# Altium project Bran_Download.PrjPcb
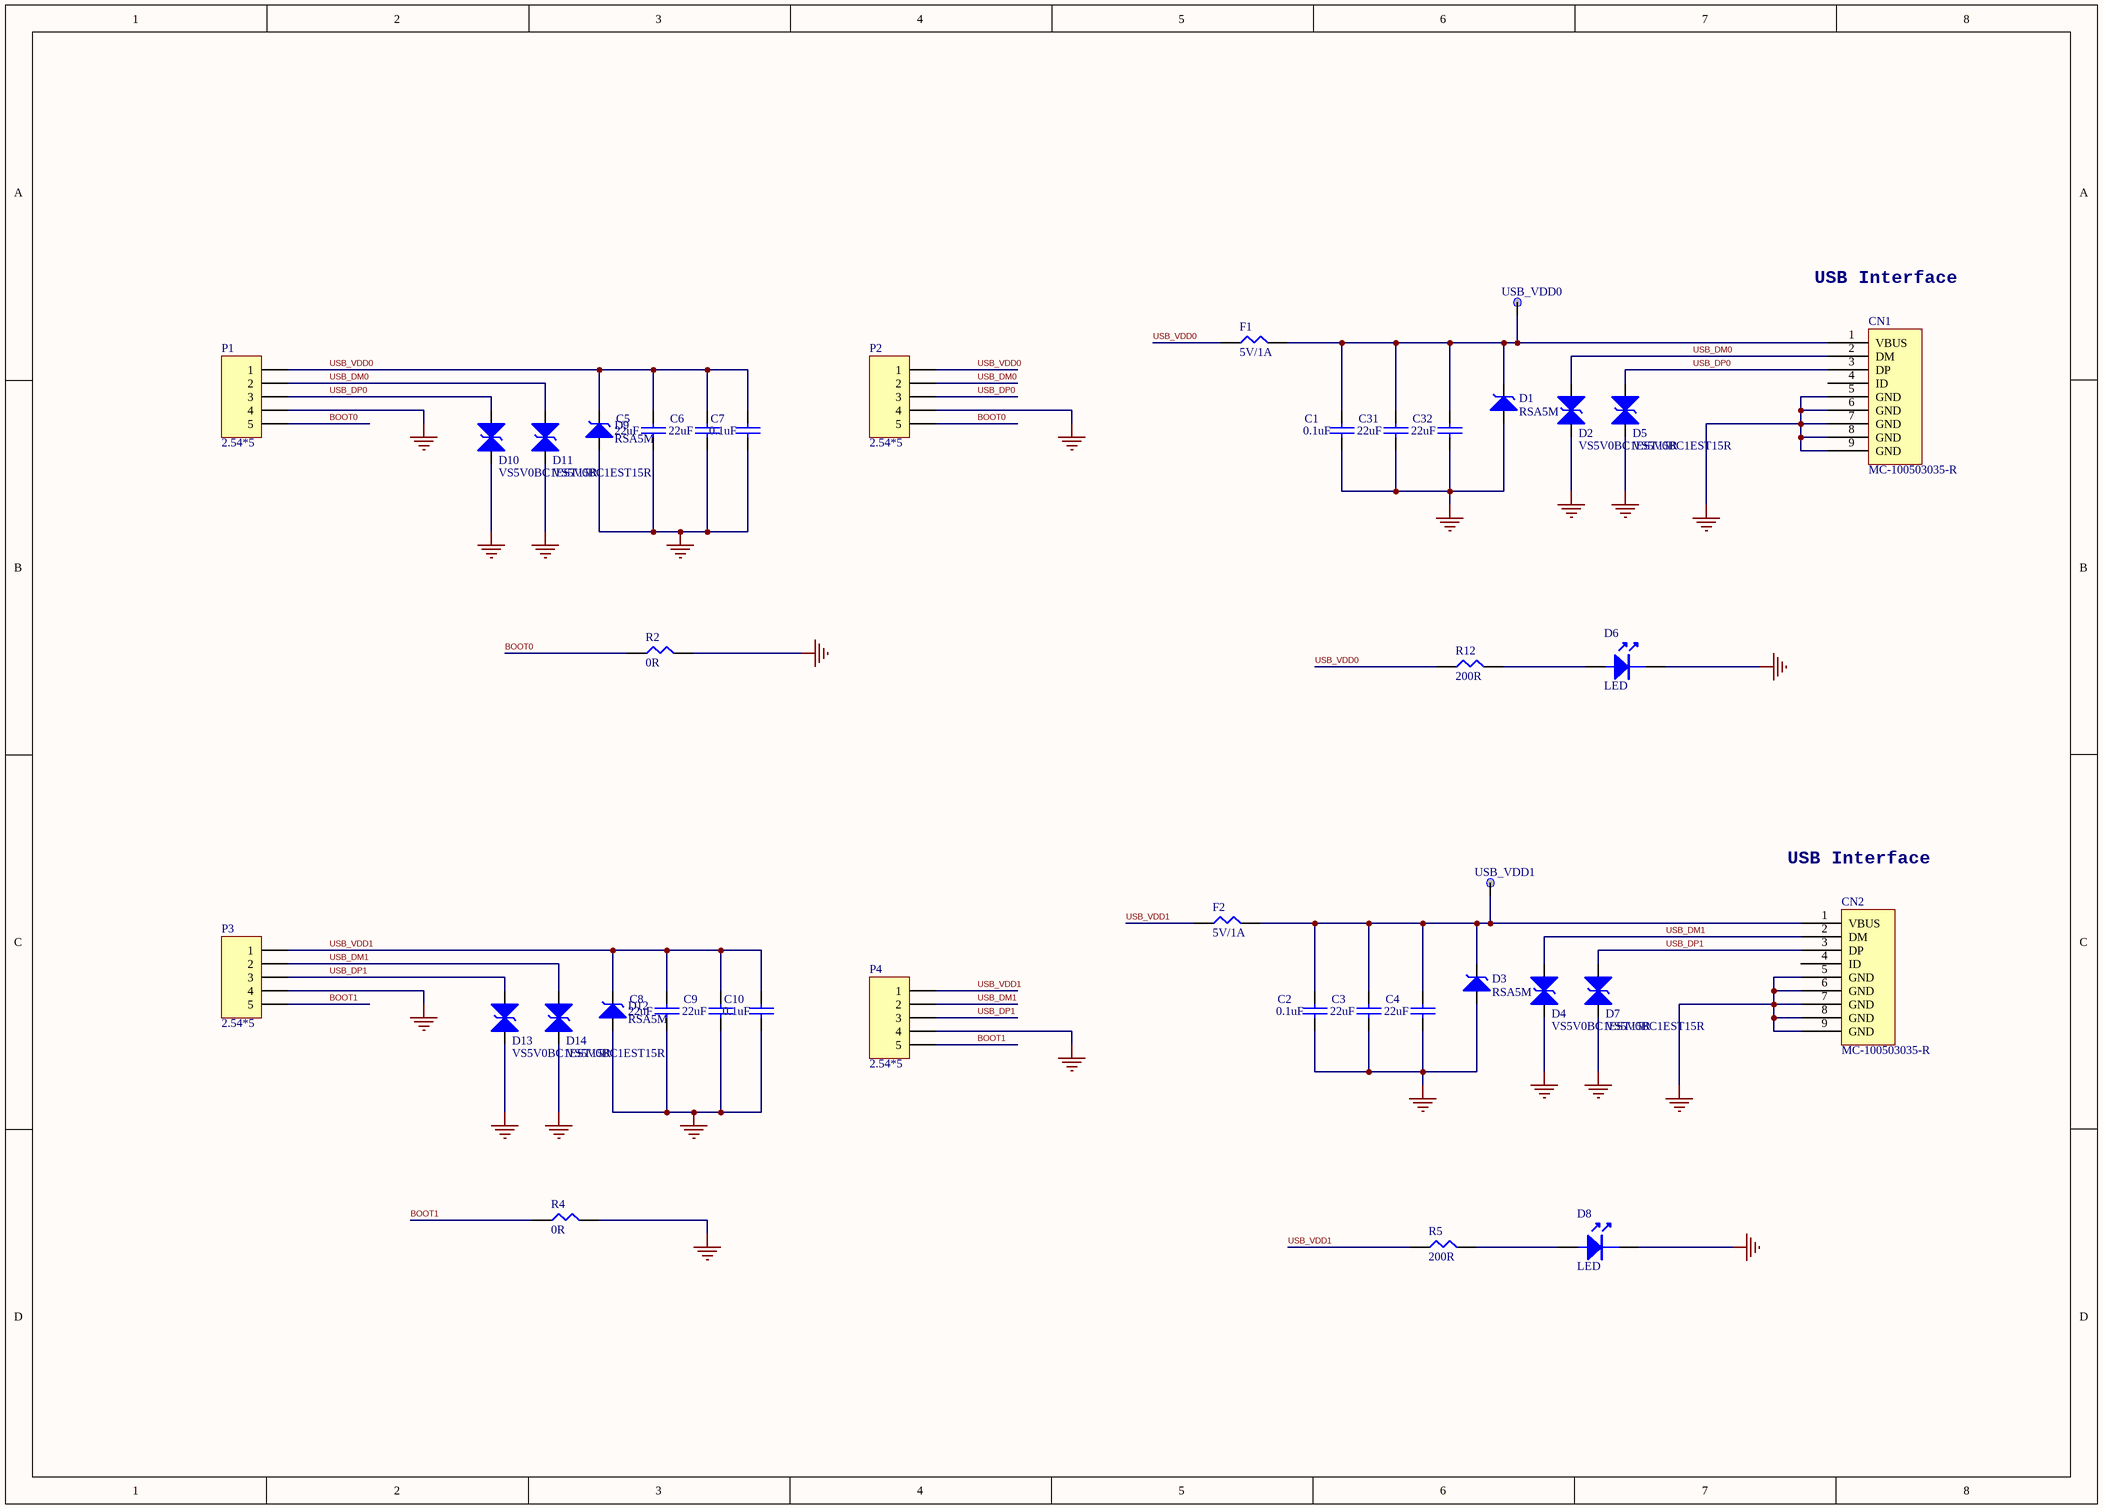
[diagram p0: Bran_Download.SchDoc]
1 sheet, 40 parts. Net scope: global (net labels, ports and power ports of the same name join across sheets).
Board file: Bran_Download.PCBDOC

## Sheet Bran_Download.SchDoc
size A3

### Parts
C1  0.1uF  [0603C]
C2  0.1uF  [0603C]
C3  22uF  [0603C]
C4  22uF  [0603C]
C5  22uF  [0603C]
C6  22uF  [0603C]
C7  0.1uF  [0603C]
C8  22uF  [0603C]
C9  22uF  [0603C]
C10  0.1uF  [0603C]
C31  22uF  [0603C]
C32  22uF  [0603C]
CN1  MC-100503035-R  [MICRO-USB-乐沪]
CN2  MC-100503035-R  [MICRO-USB-乐沪]
D1  RSA5M  [PMDU]
D2  VS5V0BC1EST15R  [ESD_0402]
D3  RSA5M  [PMDU]
D4  VS5V0BC1EST15R  [ESD_0402]
D5  VS5V0BC1EST15R  [ESD_0402]
D6  LED  [0402LED]
D7  VS5V0BC1EST15R  [ESD_0402]
D8  LED  [0402LED]
D9  RSA5M  [PMDU]
D10  VS5V0BC1EST15R  [ESD_0402]
D11  VS5V0BC1EST15R  [ESD_0402]
D12  RSA5M  [PMDU]
D13  VS5V0BC1EST15R  [ESD_0402]
D14  VS5V0BC1EST15R  [ESD_0402]
F1  5V/1A  [0603R]
F2  5V/1A  [0603R]
P1  2.54*5  [HDR1X5]
P2  2.54*5  [HDR1X5]
P3  2.54*5  [HDR1X5]
P4  2.54*5  [HDR1X5]
R2  0R  [0603R]
R4  0R  [0603R]
R5  200R  [0603R]
R12  200R  [0603R]
USB_VDD0  TP  [TP_C40]  (value not drawn)
USB_VDD1  TP  [TP_C40]  (value not drawn)

### Nets
GND: C1.2 C2.2 C3.2 C4.2 C5.2 C6.2 C7.2 C8.2 C9.2 C10.2 C31.2 C32.2 CN1.5(GND) CN1.6(GND) CN1.7(GND) CN1.8(GND) CN1.9(GND) CN2.5(GND) CN2.6(GND) CN2.7(GND) CN2.8(GND) CN2.9(GND) D1.2(dIode2) D2.1(Diode1) D3.2(dIode2) D4.1(Diode1) D5.1(Diode1) D6.1 D7.1(Diode1) D8.1 D9.2(dIode2) D10.1(Diode1) D11.1(Diode1) D12.2(dIode2) D13.1(Diode1) D14.1(Diode1) P1.4 P2.4 P3.4 P4.4 R2.2 R4.2
BOOT0: P1.5 P2.5 R2.1
BOOT1: P3.5 P4.5 R4.1
USB_DM0: CN1.2(DM) D2.2(dIode2) D11.2(dIode2) P1.2 P2.2
USB_DM1: CN2.2(DM) D4.2(dIode2) D14.2(dIode2) P3.2 P4.2
USB_DP0: CN1.3(DP) D5.2(dIode2) D10.2(dIode2) P1.3 P2.3
USB_DP1: CN2.3(DP) D7.2(dIode2) D13.2(dIode2) P3.3 P4.3
USB_VDD0: C5.1 C6.1 C7.1 D9.1(Diode1) F1.1 P1.1 P2.1 R12.1
USB_VDD1: C8.1 C9.1 C10.1 D12.1(Diode1) F2.1 P3.1 P4.1 R5.1
NetC1_1: C1.1 C31.1 C32.1 CN1.1(VBUS) D1.1(Diode1) F1.2 USB_VDD0.1
NetC2_1: C2.1 C3.1 C4.1 CN2.1(VBUS) D3.1(Diode1) F2.2 USB_VDD1.1
NetD6_2: D6.2 R12.2
NetD8_2: D8.2 R5.2

Not connected (* = marked no-connect by the designer): CN1 4(ID); CN2 4(ID)

### Notes on the sheet
- USB Interface

### Library data of the parts
C1-C10 C31 C32 = CAP: 厂家：Murata，型号：GRM188R61A106KE69D
CN1 CN2 = 475900001: Manuf_1: MOLEX; Ordered by: Subcon; Silkscreen: USB USER; Manuf_Part_1: 475900001
D1-D5 D7 D9-D14 = ESD_1: 厂家：ROHM，型号：VMNZC6.8CST2RA
D6 D8 = LED: 厂家：ROHM，型号：SCMP13WBC8W1**
F1 F2 R2 R4 R5 R12 = RES: 厂家：Yageo，型号：RC0402FR-07100KL
P1-P4 = Header 5: Header, 5-Pin; LatestRevisionDate: 17-Jul-2002; LatestRevisionNote: Re-released for DXP Platform.; Publisher: Altium Limited
USB_VDD0 USB_VDD1 = TP: Ordered by: Subcon